# EAGLE schematic DS18B20Z-Flip-Test_v3 (EAGLE 9.7.0)
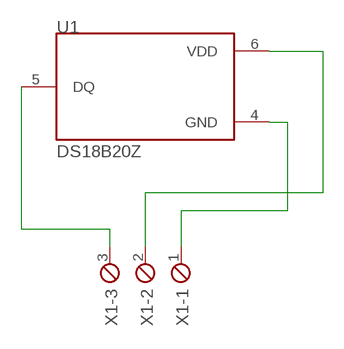
[diagram p0: schematic, sheet 1]

## Parts
U1  DS18B20Z  [SOIC127P600X175-8N]
X1  MPT3  [3POL254]

## Nets
N$1: U1.4(GND) X1.1
N$2: U1.6(VDD) X1.2
N$3: U1.5(DQ) X1.3

## Library data of the parts
U1 = DS18B20Z-FLIP:DS18B20Z: DALLAS - DALLAS DS18B20Z High-Precision 1-Wire Digital Thermometer; MANUFACTURER: Maxim Integrated; PARTREV: 5; STANDARD: IPC7351B
X1 = con-phoenix-254:MPT3: PHOENIX CONNECTOR; OC_FARNELL: unknown; OC_NEWARK: unknown